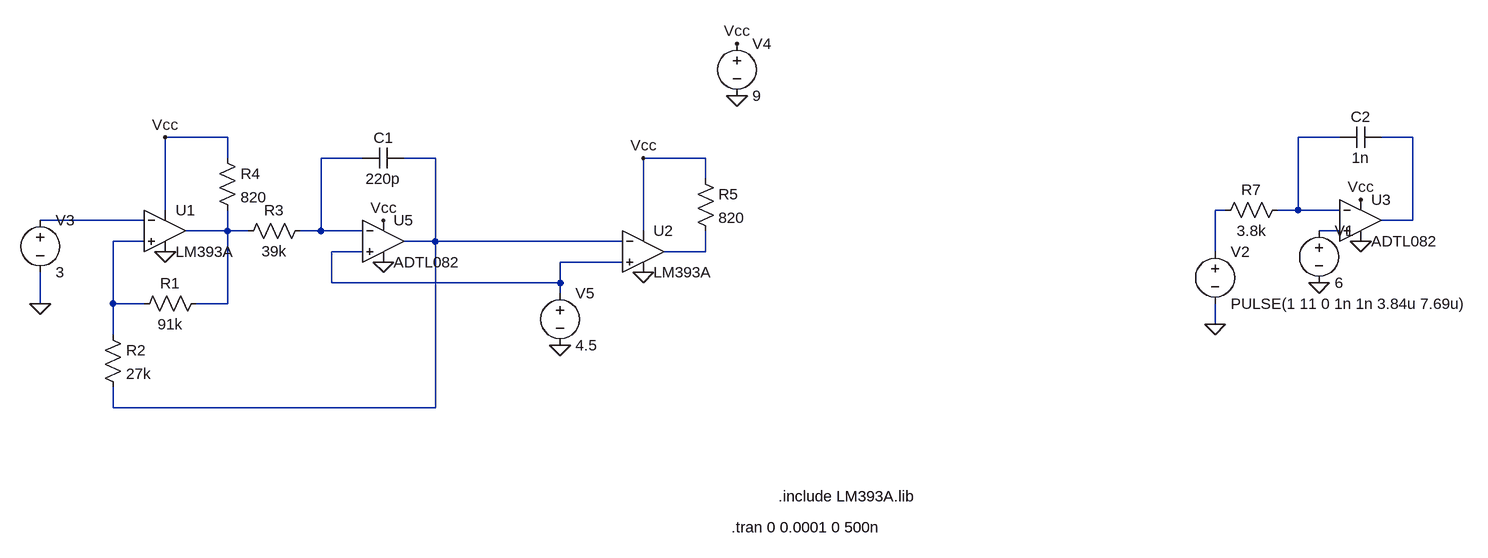
[diagram p0: schematic oscilador.asc]
oscilador.asc, the LTspice schematic file:
Version 4.1
SHEET 1 2252 836
WIRE 320 -32 224 -32
WIRE 2032 -32 1968 -32
WIRE 2144 -32 2096 -32
WIRE 320 0 320 -32
WIRE 528 0 464 0
WIRE 640 0 592 0
WIRE 1056 0 960 0
WIRE 1056 32 1056 0
WIRE 224 80 224 -32
WIRE 1856 80 1840 80
WIRE 1968 80 1968 -32
WIRE 1968 80 1936 80
WIRE 2032 80 1968 80
WIRE 192 96 32 96
WIRE 2144 96 2144 -32
WIRE 2144 96 2096 96
WIRE 320 112 320 80
WIRE 320 112 256 112
WIRE 352 112 320 112
WIRE 464 112 464 0
WIRE 464 112 432 112
WIRE 528 112 464 112
WIRE 960 112 960 0
WIRE 2032 112 2000 112
WIRE 192 128 144 128
WIRE 640 128 640 0
WIRE 640 128 592 128
WIRE 928 128 640 128
WIRE 528 144 480 144
WIRE 1056 144 1056 112
WIRE 1056 144 992 144
WIRE 1840 144 1840 80
WIRE 928 160 832 160
WIRE 480 192 480 144
WIRE 832 192 832 160
WIRE 832 192 480 192
WIRE 832 208 832 192
WIRE 32 224 32 176
WIRE 144 224 144 128
WIRE 192 224 144 224
WIRE 320 224 320 112
WIRE 320 224 272 224
WIRE 1840 256 1840 224
WIRE 144 272 144 224
WIRE 144 384 144 352
WIRE 640 384 640 128
WIRE 640 384 144 384
FLAG 224 144 0
FLAG 1104 -96 0
FLAG 560 160 0
FLAG 1104 -176 Vcc
FLAG 224 -32 Vcc
FLAG 560 96 Vcc
FLAG 2064 128 0
FLAG 2064 64 Vcc
FLAG 1840 256 0
FLAG 2000 192 0
FLAG 32 224 0
FLAG 960 176 0
FLAG 832 288 0
FLAG 960 0 Vcc
SYMBOL res 128 256 R0
SYMATTR InstName R2
SYMATTR Value 27k
SYMBOL res 288 208 R90
WINDOW 0 0 56 VBottom 2
WINDOW 3 32 56 VTop 2
SYMATTR InstName R1
SYMATTR Value 91k
SYMBOL res 448 96 R90
WINDOW 0 0 56 VBottom 2
WINDOW 3 32 56 VTop 2
SYMATTR InstName R3
SYMATTR Value 39k
SYMBOL cap 592 -16 R90
WINDOW 0 0 32 VBottom 2
WINDOW 3 32 32 VTop 2
SYMATTR InstName C1
SYMATTR Value 220p
SYMBOL voltage 1104 -192 R0
WINDOW 123 0 0 Left 0
WINDOW 39 0 0 Left 0
SYMATTR InstName V4
SYMATTR Value 9
SYMBOL res 304 -16 R0
SYMATTR InstName R4
SYMATTR Value 820
SYMBOL OpAmps\\opamp2 224 48 R0
SYMATTR InstName U1
SYMATTR Value LM393A
SYMBOL res 1952 64 R90
WINDOW 0 0 56 VBottom 2
WINDOW 3 32 56 VTop 2
SYMATTR InstName R7
SYMATTR Value 3.8k
SYMBOL cap 2096 -48 R90
WINDOW 0 0 32 VBottom 2
WINDOW 3 32 32 VTop 2
SYMATTR InstName C2
SYMATTR Value 1n
SYMBOL voltage 2000 96 R0
WINDOW 123 0 0 Left 0
WINDOW 39 0 0 Left 0
SYMATTR InstName V1
SYMATTR Value 6
SYMBOL voltage 1840 128 R0
WINDOW 123 0 0 Left 0
WINDOW 39 0 0 Left 0
SYMATTR InstName V2
SYMATTR Value PULSE(1 11 0 1n 1n 3.84u 7.69u)
SYMBOL voltage 32 80 R0
WINDOW 123 0 0 Left 0
WINDOW 39 0 0 Left 0
SYMATTR InstName V3
SYMATTR Value 3
SYMBOL OpAmps\\ADTL082 2064 32 R0
SYMATTR InstName U3
SYMBOL OpAmps\\ADTL082 560 64 R0
SYMATTR InstName U5
SYMBOL OpAmps\\opamp2 960 80 R0
SYMATTR InstName U2
SYMATTR Value LM393A
SYMBOL voltage 832 192 R0
WINDOW 123 0 0 Left 0
WINDOW 39 0 0 Left 0
SYMATTR InstName V5
SYMATTR Value 4.5
SYMBOL res 1040 16 R0
SYMATTR InstName R5
SYMATTR Value 820
TEXT 1096 568 Left 2 !.tran 0 0.0001 0 500n
TEXT 1168 520 Left 2 !.include LM393A.lib

The netlist it stands for:
* oscilador.asc
R2 N009 N004 27k
R1 N007 N009 91k
R3 N003 N007 39k
C1 N004 N003 220p
V4 Vcc 0 9
R4 Vcc N007 820
X§U1 N009 N006 Vcc 0 N007 LM393A  ; pins In+ In- V+ V- OUT
R7 N001 N005 3.8k
C2 N002 N001 1n
V1 N008 0 6
V2 N005 0 PULSE(1 11 0 1n 1n 3.84u 7.69u)
V3 N006 0 3
X§U3 N008 N001 Vcc 0 N002 ADTL082  ; pins In+ In- V+ V- OUT
X§U5 N010 N003 Vcc 0 N004 ADTL082  ; pins In+ In- V+ V- OUT
X§U2 N010 N004 Vcc 0 N011 LM393A  ; pins In+ In- V+ V- OUT
V5 N010 0 4.5
R5 Vcc N011 820
.tran 0 0.0001 0 500n
.include LM393A.lib
.lib ADI.lib
.backanno
.end